# EAGLE design AppleTV (EAGLE 7.6.0)
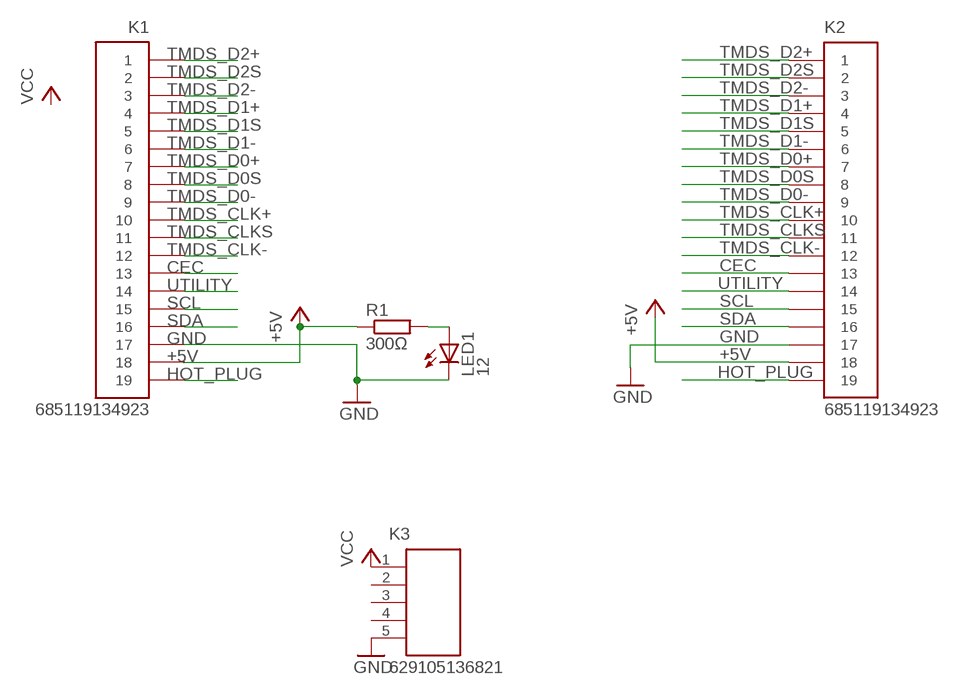
[diagram p0: schematic, sheet 1]

## Parts
K1  685119134923  [685119134923]
K2  685119134923  [685119134923]
K3  629105136821  [629105136821]
LED1  12  LEDCHIPLED_1206  [CHIPLED_1206]
R1  300Ω  R-EU_R0805  [R0805]

## Nets
+5V: K2.18 R1.1
CEC: K1.13 K2.13
GND: K1.17 K2.17 K3.5 LED1.C
HOT_PLUG: K1.19 K2.19
N$1: LED1.A R1.2
SCL: K1.15 K2.15
SDA: K1.16 K2.16
TMDS_CLK+: K1.10 K2.10
TMDS_CLK-: K1.12 K2.12
TMDS_CLKS: K1.11 K2.11
TMDS_D0+: K1.7 K2.7
TMDS_D0-: K1.9 K2.9
TMDS_D0S: K1.8 K2.8
TMDS_D1+: K1.4 K2.4
TMDS_D1-: K1.6 K2.6
TMDS_D1S: K1.5 K2.5
TMDS_D2+: K1.1 K2.1
TMDS_D2-: K1.3 K2.3
TMDS_D2S: K1.2 K2.2
UTILITY: K1.14 K2.14
VCC: K3.1
Unconnected: K1.18 K3.2 K3.3 K3.4

## Library data of the parts
K1 K2 = Input-Output_Connectors_rev15d:685119134923: WR-COM SMT Horizontal HDMI, 19 pins=>Code : Con_I-O_COM_HDMI_685119134923 <http://katalog.we-online.de/media/images/eican/Con_I-O_COM_HDMI_685119134923_pf2.jpg> Details see: http://katalog.we-online.de/en/em/685_119_134_923 Created 2014-07-09, Karrer Zheng 2014 (C) Würth Elektronik
K3 = Input-Output_Connectors_rev15d:629105136821: WR-COM SMT Horizontal 5 Contacts Micro USB Type B,5 pins=>Code : Con_I-O_COM_MicroUSB_629105136821 <http://katalog.we-online.de/media/images/eican/Con_I-O_COM_MicroUSB_629105136821_pf2.jpg> Details see: http://katalog.we-online.de/en/em/629_105_136_821 Created 2014-07-09, Karrer Zheng 2014 (C) Würth Elektronik
LED1 = led:LED: LED OSRAM: - CHIPLED LG R971, LG N971, LY N971, LG Q971, LY Q971, LO R971, LY R971 LH N974, LH R974 LS Q976, LO Q976, LY Q976 LO Q996 - Hyper CHIPLED LW Q18S LB Q993, LB Q99A, LB R99A - SideLED LS A670, LO A670, LY A670, LG A670, LP A670 LB A673, LV A673, LT A673, LW A673 LH A674 LY A675 LS A676, LA A676, LO A676, LY A676, LW A676 LS A679, LY A679, LG A679 - Hyper Micro SIDELED® LS Y876, LA Y876, LO Y876, LY Y876 LT Y87S - SmartLED LW L88C, LW L88S LB L89C, LB L89S, LG L890 LS L89K, LO L89K, LY L89K LS L896, LA L896, LO L896, LY L896 - TOPLED LS T670, LO T670, LY T670, LG T670, LP T670 LSG T670, LSP T670, LSY T670, LOP T670, LYG T670 LG T671, LOG T671, LSG T671 LB T673, LV T673, LT T673, LW T673 LH T674 LS T676, LA T676, LO T676, LY T676, LB T676, LH T676, LSB T676, LW T676 LB T67C, LV T67C, LT T67C, LS T67K, LO T67K, LY T67K, LW E67C LS E67B, LA E67B, LO E67B, LY E67B, LB E67C, LV E67C, LT E67C LW T67C LS T679, LY T679, LG T679 LS T770, LO T770, LY T770, LG T770, LP T770 LB T773, LV T773, LT T773, LW T773 LH T774 LS E675, LA E675, LY E675, LS T675 LS T776, LA T776, LO T776, LY T776, LB T776 LHGB T686 LT T68C, LB T68C - Hyper Mini TOPLED® LB M676 - Mini TOPLED Santana® LG M470 LS M47K, LO M47K, LY M47K Source: http://www.osram.convergy.de LUXEON: - LUMILED® LXK2-PW12-R00, LXK2-PW12-S00, LXK2-PW14-U00, LXK2-PW14-V00 LXK2-PM12-R00, LXK2-PM12-S00, LXK2-PM14-U00 LXK2-PE12-Q00, LXK2-PE12-R00, LXK2-PE12-S00, LXK2-PE14-T00, LXK2-PE14-U00 LXK2-PB12-K00, LXK2-PB12-L00, LXK2-PB12-M00, LXK2-PB14-N00, LXK2-PB14-P00, LXK2-PB14-Q00 LXK2-PR12-L00, LXK2-PR12-M00, LXK2-PR14-Q00, LXK2-PR14-R00 LXK2-PD12-Q00, LXK2-PD12-R00, LXK2-PD12-S00 LXK2-PH12-R00, LXK2-PH12-S00 LXK2-PL12-P00, LXK2-PL12-Q00, LXK2-PL12-R00 Source: www.luxeon.com KINGBRIGHT: KA-3528ASYC Source: www.kingbright.com
R1 = resistor:R-EU_: RESISTOR, European symbol

## Board
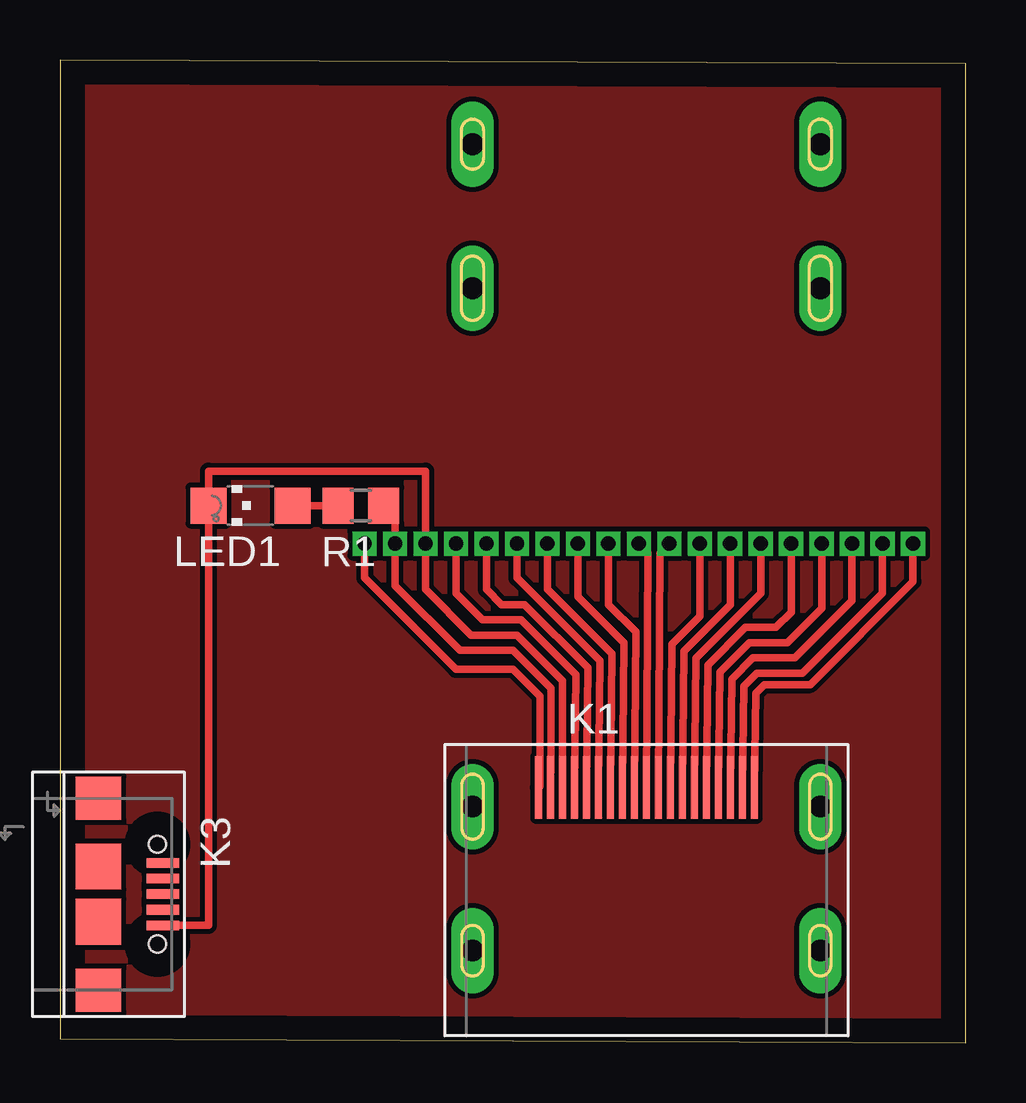
[diagram p1: board, top side]
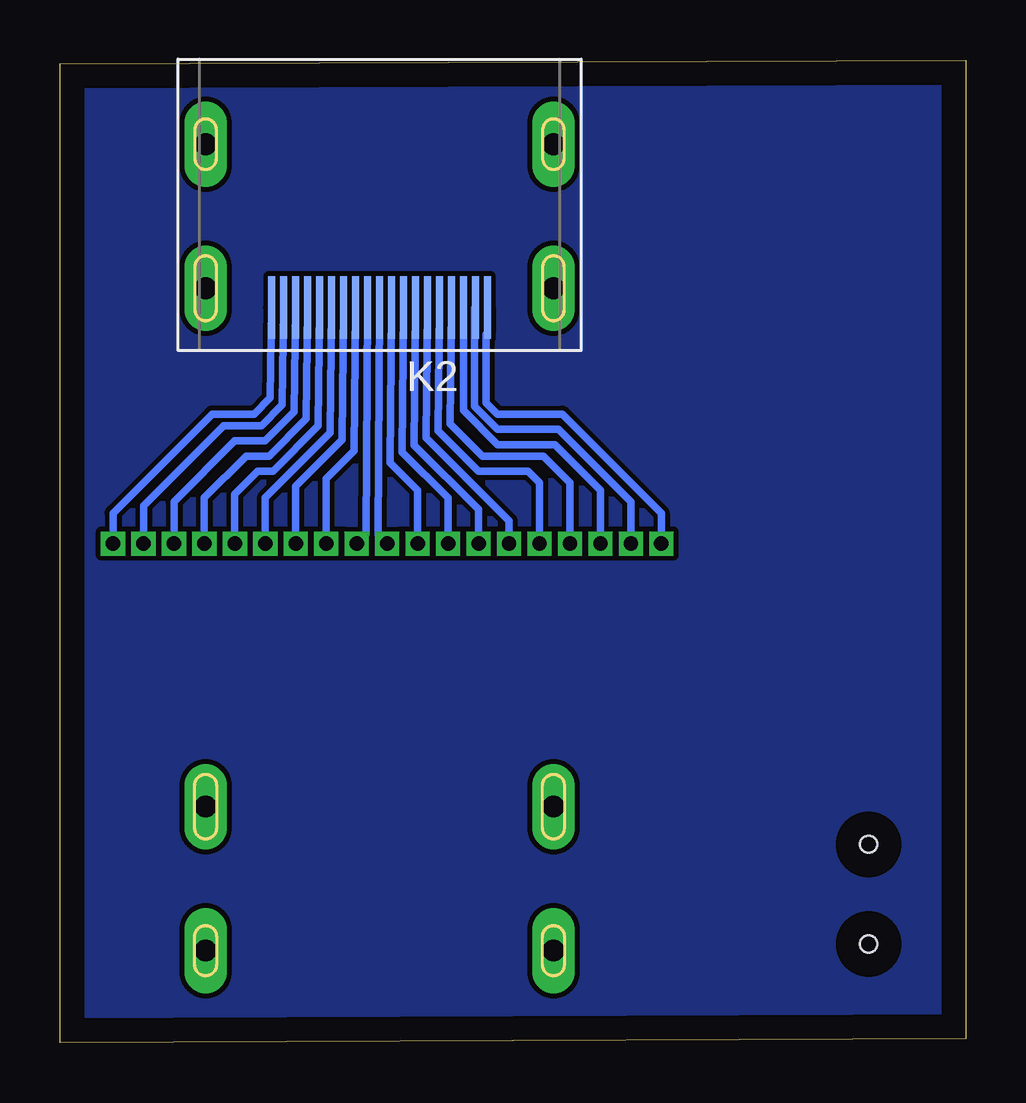
[diagram p2: board, bottom side, seen from below]

Size 37.77 x 40.95 mm. Coordinates in mm from the lower left corner, seen from the top.
Outline: 0,0.16 37.77,0 37.77,40.79 0,40.95 0,0.16
Copper layers (1*16): Top 0.035mm / dielectric 1.5mm / Bottom 0.035mm
Design rules "default": minimum track width 10mil, minimum drill 24mil, track to track 8mil, track to pad 8mil, pad to pad 8mil, via to via 8mil, smd to smd 8mil, copper to edge 40mil, drill to drill 8mil, minimum pad ring 10mil, minimum via ring 8mil, stop-mask expansion 4mil, vias tented up to drill 0mil, thermal gap 10mil

### Footprints (pad centres in the part's own frame; a part is rotated, then mirrored left to right if it is on the bottom)
685119134923 = smd 0.28 x 2.6: 1 4.5,0; 2 4,0; 3 3.5,0; 4 3,0; 5 2.5,0; 6 2,0; 7 1.5,0; 8 1,0; 9 0.5,0; 10 0,0; 11 -0.5,0; 12 -1,0; 13 -1.5,0; 14 -2,0; 15 -2.5,0; 16 -3,0; 17 -3.5,0; 18 -4,0; 19 -4.5,0 | drill 0.9 pad 1.778 long: Z1 -7.25,-0.8; Z2 -7.25,-6.8; Z3 7.25,-6.8; Z4 7.25,-0.8
629105136821 = smd 0.4 x 1.35: 1 -1.3,0; 2 -0.65,0; 3 0,0; 4 0.65,0; 5 1.3,0 | smd 1.8 x 1.9: Z1 -4,-2.675; Z4 4,-2.675 | smd 1.9 x 1.9: Z2 -1.15,-2.675; Z3 1.15,-2.675 | hole 0.7: -2.075,-0.225; 2.075,-0.225
CHIPLED_1206 = smd 1.5 x 1.5: A 0,-1.75; C 0,1.75
R0805 = smd 1.3 x 1.5: 1 -0.95,0; 2 0.95,0

### Placement (x,y rotation side)
K1  24.45,10.64 0 top
K2  24.45,30.64 180 bottom
K3  4.29,6.19 270 top
LED1  7.94,22.38 90 top
R1  12.54,22.38 180 top

### Tracks (layer width: path | path; a pad name or v marks a point on that pad's centre or on a via)
+5V  (via drill 0.6)
  Top 0.305: 20.48,11.27 20.48,14.76 18.89,16.35 16.67,16.35 13.97,19.05 v13.97,20.8 13.97,22.38 R1.1
  Bottom 0.305: v13.97,20.8 13.97,22.54 16.99,25.56 19.53,25.56 20.48,26.51 20.48,30.61 K2.18
CEC  (via drill 0.6)
  Top 0.305: K1.13 23,16.21 20.32,18.89 v20.32,20.8
  Bottom 0.305: K2.13 23,24.9 20.32,22.22 v20.32,20.8
GND  (via drill 0.6)
  Top 0.305: K1.17 20.95,15.09 19.05,16.99 17.14,16.99 15.24,18.89 v15.24,20.8 15.24,23.81 6.19,23.81 LED1.C 6.19,4.89 K3.5
  Bottom 0.305: v15.24,20.8 15.24,23.02 17.14,24.92 19.53,24.92 20.95,26.35 K2.17
HOT_PLUG  (via drill 0.6)
  Top 0.305: v12.7,20.8 12.7,19.37 16.51,15.56 18.89,15.56 20,14.45 20,10.69 K1.19
  Bottom 0.305: K2.19 19.95,29.58 20,29.53 20,26.67 19.53,26.19 16.83,26.19 12.7,22.07 v12.7,20.8
N$1
  Top 0.305: R1.2 LED1.A
N$18
  pour Bottom: 0,40.96 37.78,40.96 37.78,0 0,0
N$20
  pour Top: 0,40.96 37.78,40.96 37.78,0 0,0
SCL  (via drill 0.6)
  Top 0.305: K1.15 22,15.62 19.37,18.26 18.41,18.26 17.78,18.89 v17.78,20.8
  Bottom 0.305: K2.15 22,25.49 20.32,23.81 18.26,23.81 17.78,23.34 v17.78,20.8
SDA  (via drill 0.6)
  Top 0.305: K1.16 21.5,15.33 19.21,17.62 17.62,17.62 16.51,18.73 v16.51,20.8
  Bottom 0.305: K2.16 21.5,25.79 20.16,24.45 17.62,24.45 16.51,23.34 v16.51,20.8
TMDS_CLK+  (via drill 0.6)
  Top 0.305: K1.10 24.5,20.43 v24.13,20.8
  Bottom 0.305: K2.10 24.5,21.17 v24.13,20.8
TMDS_CLK-  (via drill 0.6)
  Top 0.305: K1.12 23.5,16.66 21.59,18.57 v21.59,20.8
  Bottom 0.305: K2.12 23.5,24.61 21.59,22.7 v21.59,20.8
TMDS_CLKS  (via drill 0.6)
  Top 0.305: K1.11 24,17.12 22.86,18.26 v22.86,20.8
  Bottom 0.305: K2.11 24,24.16 22.86,23.02 v22.86,20.8
TMDS_D0+  (via drill 0.6)
  Top 0.305: K1.7 26,16.32 27.94,18.26 v27.94,20.8
  Bottom 0.305: K2.7 26,25.12 27.94,23.18 v27.94,20.8
TMDS_D0-  (via drill 0.6)
  Top 0.305: K1.9 25,20.4 v25.4,20.8
  Bottom 0.305: K2.9 25,21.2 v25.4,20.8
TMDS_D0S  (via drill 0.6)
  Top 0.305: K1.8 25.5,16.61 26.67,17.78 v26.67,20.8
  Bottom 0.305: K2.8 25.5,24.66 26.67,23.49 v26.67,20.8
TMDS_D1+  (via drill 0.6)
  Top 0.305: K1.4 27.5,15.43 28.73,16.67 30.32,16.67 31.75,18.1 v31.75,20.8
  Bottom 0.305: K2.4 27.5,26 29.05,24.45 30,24.45 31.75,22.7 v31.75,20.8
TMDS_D1-  (via drill 0.6)
  Top 0.305: K1.6 26.5,16.02 29.21,18.73 v29.21,20.8
  Bottom 0.305: K2.6 26.5,25.41 29.21,22.7 v29.21,20.8
TMDS_D1S  (via drill 0.6)
  Top 0.305: K1.5 27,15.73 28.57,17.3 29.84,17.3 30.48,17.94 v30.48,20.8
  Bottom 0.305: K2.5 27,25.7 28.89,23.81 29.53,23.81 30.48,22.86 v30.48,20.8
TMDS_D2+  (via drill 0.6)
  Top 0.305: K1.1 29,14.55 29.37,14.92 31.27,14.92 35.56,19.21 v35.56,20.8
  Bottom 0.305: K2.1 29,26.88 29.69,26.19 31.43,26.19 35.56,22.07 v35.56,20.8
TMDS_D2-  (via drill 0.6)
  Top 0.305: K1.3 28,15.14 28.89,16.03 30.64,16.03 33.02,18.41 v33.02,20.8
  Bottom 0.305: K2.3 28,26.29 29.21,25.08 30.48,25.08 33.02,22.54 v33.02,20.8
TMDS_D2S  (via drill 0.6)
  Top 0.305: K1.2 28.5,14.85 29.05,15.4 30.96,15.4 34.29,18.73 v34.29,20.8
  Bottom 0.305: K2.2 28.5,26.59 29.37,25.72 30.96,25.72 34.29,22.38 v34.29,20.8
UTILITY  (via drill 0.6)
  Top 0.305: K1.14 22.5,15.92 19.05,19.37 v19.05,20.8
  Bottom 0.305: K2.14 22.5,25.2 19.05,21.75 v19.05,20.8